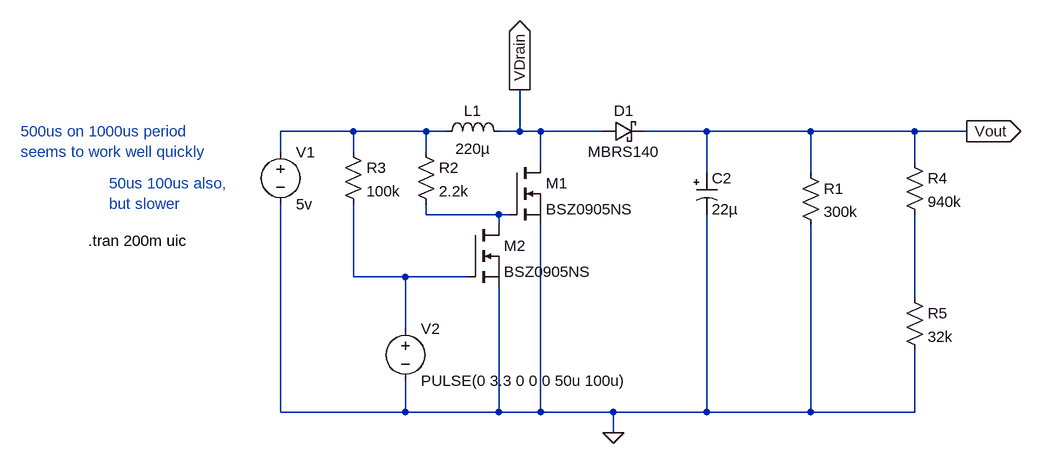
[diagram p0: schematic test boost.asc]
test boost.asc, the LTspice schematic file:
Version 4
SHEET 1 992 680
WIRE -64 -32 -176 -32
WIRE 48 -32 -64 -32
WIRE 80 -32 48 -32
WIRE 192 -32 192 -96
WIRE 192 -32 160 -32
WIRE 224 -32 192 -32
WIRE 320 -32 224 -32
WIRE 480 -32 384 -32
WIRE 640 -32 480 -32
WIRE 800 -32 640 -32
WIRE 880 -32 800 -32
WIRE -176 0 -176 -32
WIRE -64 0 -64 -32
WIRE 48 0 48 -32
WIRE 224 16 224 -32
WIRE 800 16 800 -32
WIRE 480 32 480 -32
WIRE 640 32 640 -32
WIRE 48 96 48 80
WIRE 160 96 48 96
WIRE 176 96 160 96
WIRE 160 112 160 96
WIRE -64 192 -64 80
WIRE 16 192 -64 192
WIRE 112 192 16 192
WIRE 800 224 800 96
WIRE 16 272 16 192
WIRE -176 400 -176 80
WIRE 16 400 16 352
WIRE 16 400 -176 400
WIRE 160 400 160 208
WIRE 160 400 16 400
WIRE 224 400 224 112
WIRE 224 400 160 400
WIRE 336 400 224 400
WIRE 480 400 480 96
WIRE 480 400 336 400
WIRE 640 400 640 112
WIRE 640 400 480 400
WIRE 800 400 800 304
WIRE 800 400 640 400
WIRE 336 432 336 400
FLAG 336 432 0
FLAG 192 -96 VDrain
IOPIN 192 -96 Out
FLAG 880 -32 Vout
IOPIN 880 -32 Out
SYMBOL ind 64 -16 R270
WINDOW 0 32 56 VTop 2
WINDOW 3 5 56 VBottom 2
SYMATTR InstName L1
SYMATTR Value 220µ
SYMBOL nmos 176 16 R0
SYMATTR InstName M1
SYMATTR Value BSZ0905NS
SYMBOL schottky 320 -16 R270
WINDOW 0 32 32 VTop 2
WINDOW 3 0 32 VBottom 2
SYMATTR InstName D1
SYMATTR Value MBRS140
SYMATTR Description Diode
SYMATTR Type diode
SYMBOL res 624 16 R0
SYMATTR InstName R1
SYMATTR Value 300k
SYMATTR SpiceLine tol=5 pwr=.25w
SYMBOL voltage -176 -16 R0
WINDOW 123 0 0 Left 0
WINDOW 39 0 0 Left 0
SYMATTR InstName V1
SYMATTR Value 5v
SYMBOL voltage 16 256 R0
WINDOW 123 0 0 Left 0
WINDOW 39 0 0 Left 0
SYMATTR InstName V2
SYMATTR Value PULSE(0 3.3 0 0 0 50u 100u)
SYMBOL polcap 464 32 R0
WINDOW 3 24 56 Left 2
SYMATTR Value 22µ
SYMATTR InstName C2
SYMATTR Description Capacitor
SYMATTR Type cap
SYMATTR SpiceLine V=400 Irms=162m Rser=0.408322 Lser=4.41071n mfg="Würth Elektronik" pn="860021375012 WCAP-ATG5 10x25" type="Al electrolytic"
SYMBOL nmos 112 112 R0
SYMATTR InstName M2
SYMATTR Value BSZ0905NS
SYMBOL res 32 -16 R0
SYMATTR InstName R2
SYMATTR Value 2.2k
SYMATTR SpiceLine tol=5 pwr=.25w
SYMBOL res -80 -16 R0
SYMATTR InstName R3
SYMATTR Value 100k
SYMATTR SpiceLine tol=5 pwr=.25w
SYMBOL res 784 0 R0
SYMATTR InstName R4
SYMATTR Value 940k
SYMBOL res 784 208 R0
SYMATTR InstName R5
SYMATTR Value 32k
TEXT -472 136 Left 2 !.tran 200m uic
TEXT -576 -32 Left 2 ;500us on 1000us period \nseems to work well quickly
TEXT -440 48 Left 2 ;50us 100us also,\nbut slower

The netlist it stands for:
* test boost.asc
L1 N001 VDrain 220µ
M1 VDrain N002 0 0 BSZ0905NS
D1 VDrain Vout MBRS140
R1 Vout 0 300k tol=5 pwr=.25w
V1 N001 0 5v
V2 N003 0 PULSE(0 3.3 0 0 0 50u 100u)
C2 Vout 0 22µ V=400 Irms=162m Rser=0.408322 Lser=4.41071n mfg="Würth Elektronik" pn="860021375012 WCAP-ATG5 10x25" type="Al electrolytic"
M2 N002 N003 0 0 BSZ0905NS
R2 N001 N002 2.2k tol=5 pwr=.25w
R3 N001 N003 100k tol=5 pwr=.25w
R4 Vout N004 940k
R5 N004 0 32k
.model D D
.lib standard.dio
.model NMOS NMOS
.model PMOS PMOS
.lib standard.mos
.tran 200m uic
* 500us on 1000us period
* seems to work well quickly
* 50us 100us also,
* but slower
.backanno
.end